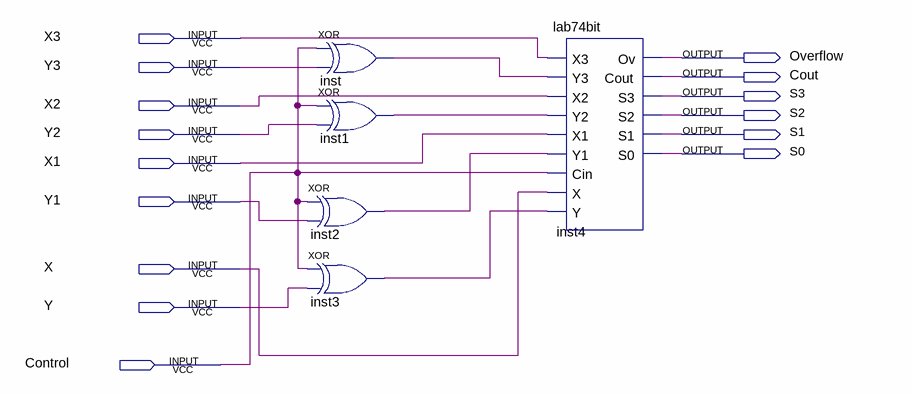
[diagram p0: schematic sheet]
// Quartus schematic lab7addersub.bdf as structural Verilog: 5 symbols, 15 pins
module lab7addersub (
  input  X3,
  input  Y3,
  input  X2,
  input  Y2,
  input  X1,
  input  Y1,
  input  X,
  input  Y,
  input  Control,
  output Overflow,
  output Cout,
  output S3,
  output S2,
  output S1,
  output S0
);

  wire inst1_out, inst2_out, inst3_out, inst_out;

  xor inst (inst_out, Control, Y3);
  xor inst1 (inst1_out, Control, Y2);
  xor inst2 (inst2_out, Control, Y1);
  xor inst3 (inst3_out, Control, Y);
  lab74bit inst4 (
    .X3(X3), .Y3(inst_out), .X2(X2), .Y2(inst1_out), .X1(X1), .Y1(inst2_out), .Cin(Control), .X(X),
    .Y(inst3_out), .Ov(Overflow), .Cout(Cout), .S3(S3), .S2(S2), .S1(S1), .S0(S0));
endmodule
